# Altium schematic sheet 1_PFC.SchDoc (part 4 of 4)
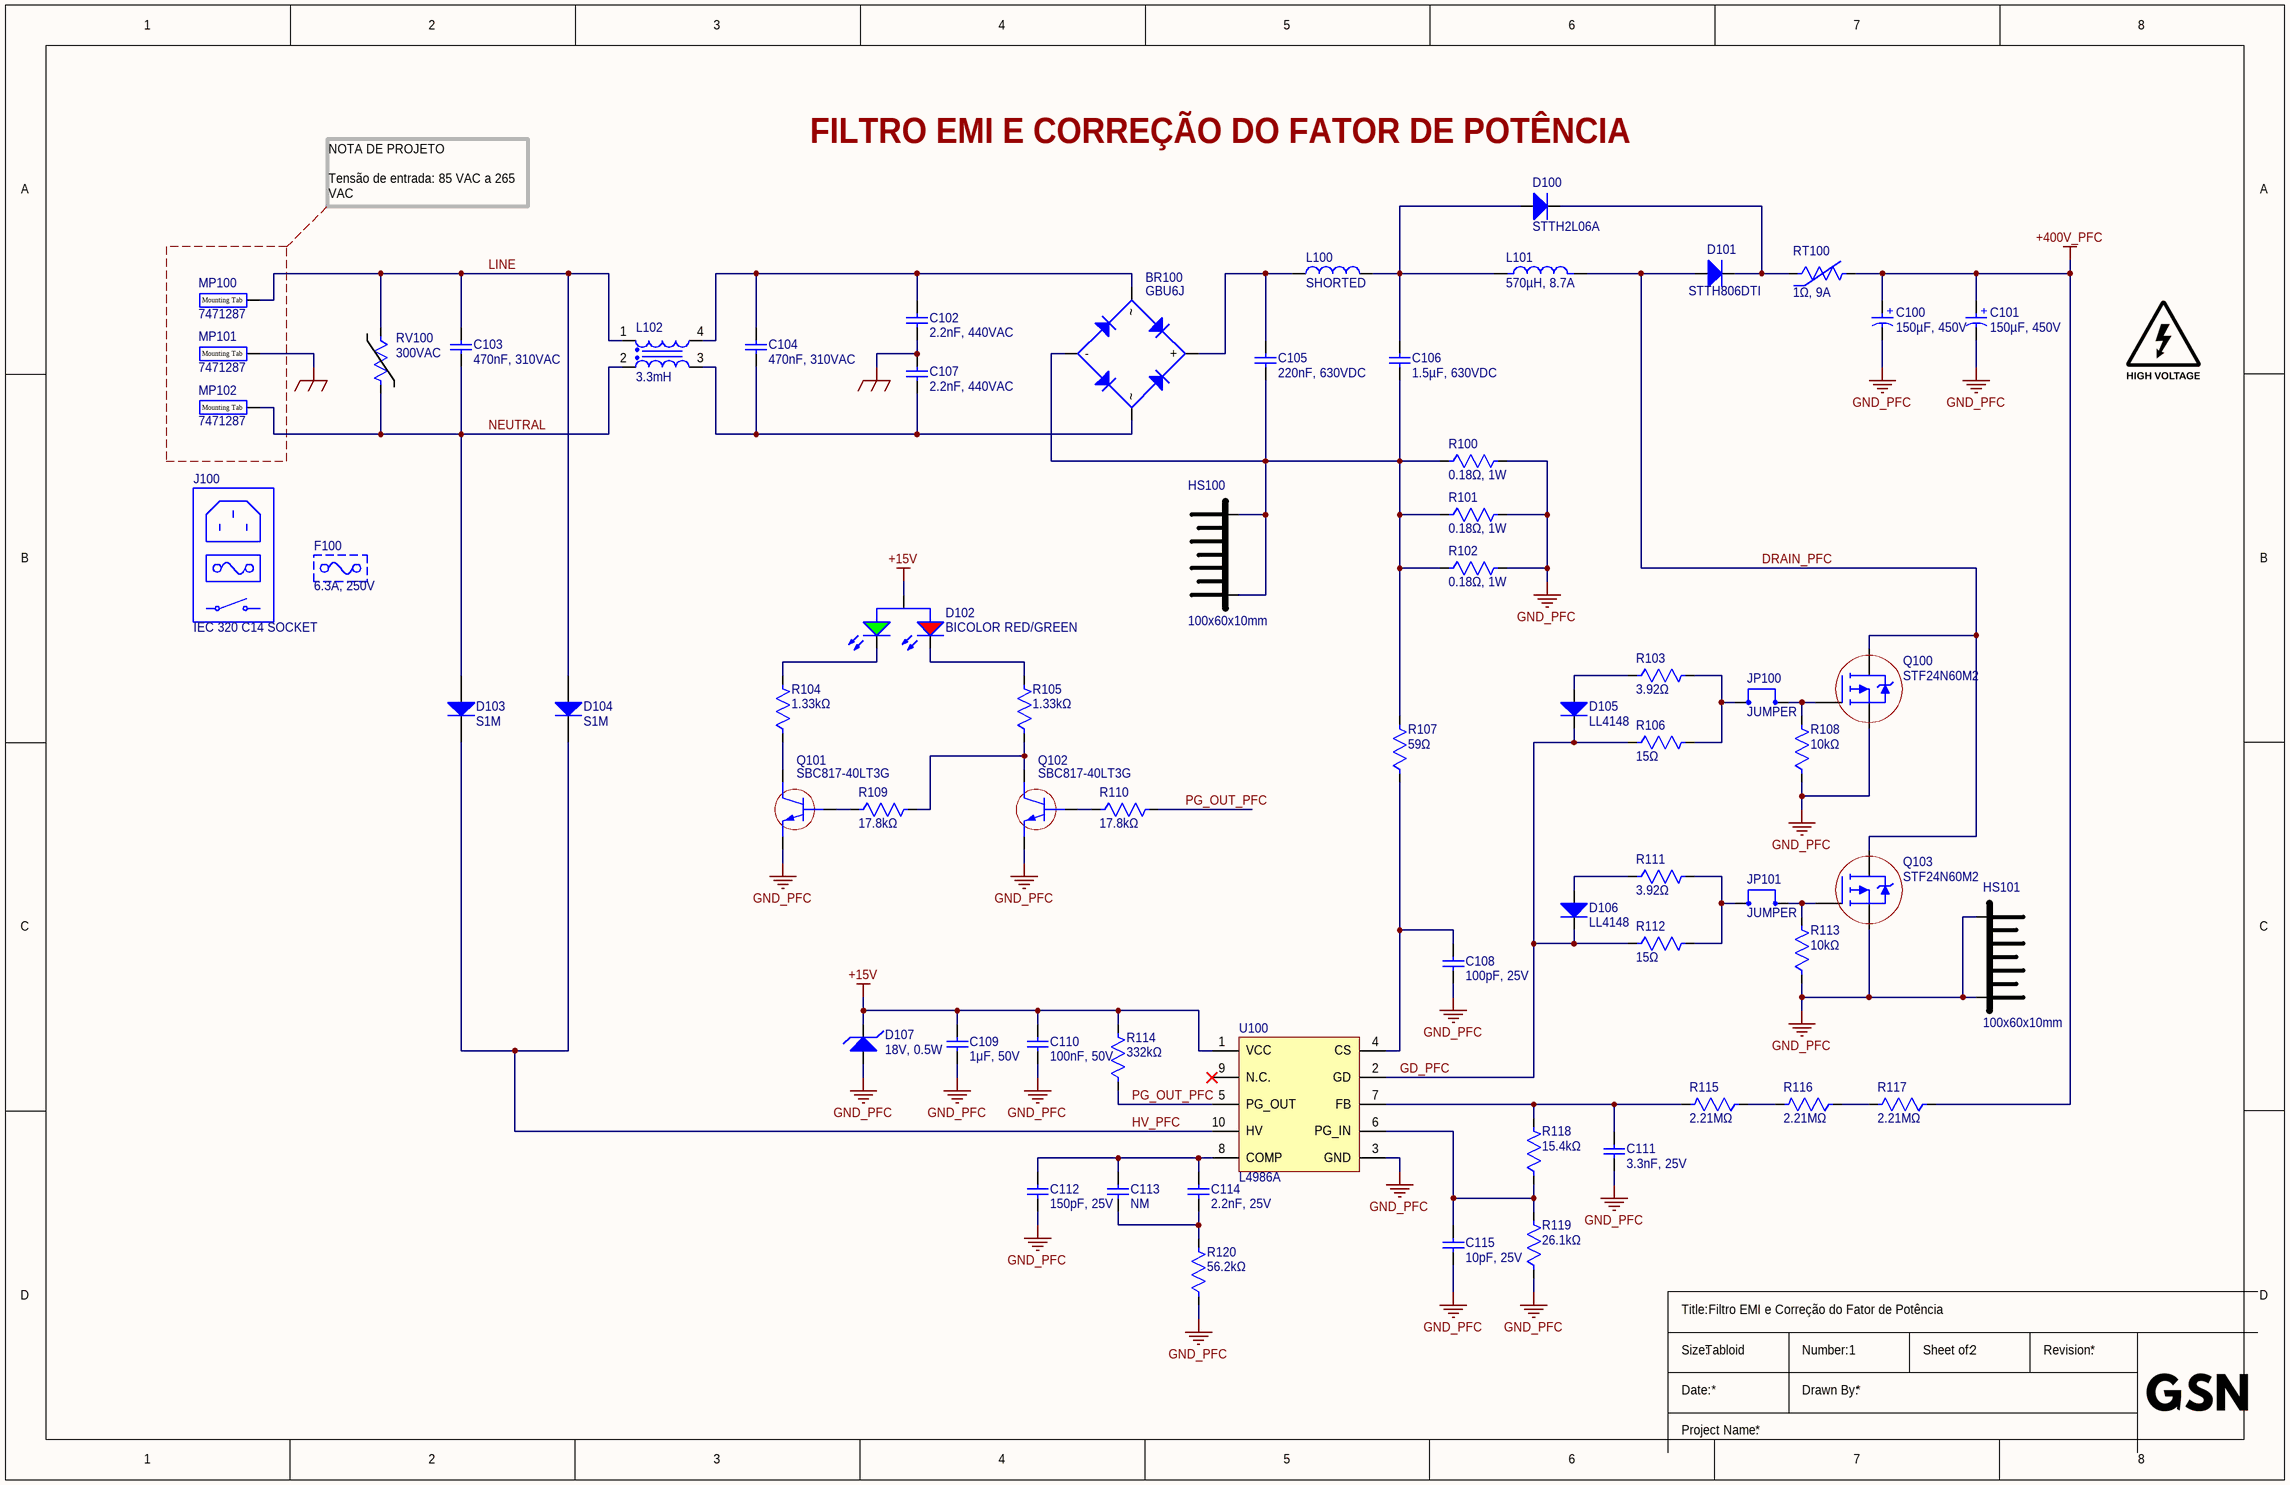
[diagram p3: 1_PFC.SchDoc]

## Library data of the parts (continued)
R108 R113 = RC0805FR-0710KL: RES 10K OHM 1% 1/8W 0805; Manufacturer: Yageo Group; Max Power Dissipation: 125mW; Temperature Coefficient: 100ppm/°C; Voltage Rating: 150V; Supplier: DigiKey; Supplier Part Number: 311-10.0KCRCT-ND; Manufacturer Part Number: RC0805FR-0710KL; RoHS: Compliant; Category: Chip SMD Resistors; Stock: 2846345; Pricing: 1=0.13, 10=0.009, 25=0.0088, 50=0.0082 (USD); Case/Package: 0805; Case Code (Imperial): 0805; China RoHS: Non-Compliant; Composition: Thick Film; Country of Origin: Mainland China, Taiwan; Depth: 1.25mm; Export Control Classification Number (ECCN) Code: EAR99; Features: Moisture Resistant; Height: 500µm; Harmonized Tariff Schedule (HTS) Code: 8533.21.00.30; Introduction Date: 2004-09-22; Lead Free: Lead Free; Length: 2mm; Lifecycle Status: Production; Max Operating Temperature: 155°C; Military Standard: Not; Min Operating Temperature: -55°C; Mounting Technology: Surface Mount; Pins: 2; Number of Terminals: 2; Number of Terminations: 2; Packaging: Tape and Reel; Power Dissipation: 125mW; Power Rating: 125mW; REACH SVHC: Yes; Value: 10kΩ; Schedule B: 8533210045, 8533210045|8533210045|8533210045|8533210045|8533210045|8533210045|8533210045|8533210045|8533210045|8533210045|8533210045|8533210045|8533210045|8533210045|8533210045|8533210045|8533210045|8533210045|8533210045|8533210045|8533210045|8533210045|8533210045|85; Termination: SMD/SMT; Tolerance: 1%; Voltage Rating (AC): 150V; Width: 1.25mm; Working Voltage: 150V; ComponentLink1URL: https://datasheet.octopart.com:443/RC0805FR-0710KL-Yageo-datasheet-175887523.pdf?src-supplier=Newark; ComponentLink1Description: https://datasheet.octopart.com:443/RC0805FR-0710KL-Yageo-datasheet-175887523.pdf?src-supplier=Newark; ComponentLink2URL: https://datasheet.octopart.com:443/RC0805FR-0710KL-Yageo-datasheet-62067350.pdf?src-supplier=Farnell; ComponentLink2Description: https://datasheet.octopart.com:443/RC0805FR-0710KL-Yageo-datasheet-62067350.pdf?src-supplier=Farnell; ComponentLink3URL: https://datasheet.octopart.com:443/RC0805FR-0710KL-Yageo-datasheet-13691069.pdf?src-supplier=Farnell; ComponentLink3Description: https://datasheet.octopart.com:443/RC0805FR-0710KL-Yageo-datasheet-13691069.pdf?src-supplier=Farnell; ComponentLink4URL: https://datasheet.octopart.com:443/RC0805FR-0710KL-Yageo-datasheet-103092701.pdf?src-supplier=Upverter; ComponentLink4Description: https://datasheet.octopart.com:443/RC0805FR-0710KL-Yageo-datasheet-103092701.pdf?src-supplier=Upverter; ComponentLink5URL: https://datasheet.octopart.com:443/RC0805FR-0710KL-Yageo-datasheet-98239111.pdf?src-supplier=Upverter; ComponentLink5Description: https://datasheet.octopart.com:443/RC0805FR-0710KL-Yageo-datasheet-98239111.pdf?src-supplier=Upverter; ComponentLink6URL: https://datasheet.octopart.com:443/RC0805FR-0710KL-Yageo---Phycomp-datasheet-67302840.pdf?src-supplier=Upverter; ComponentLink6Description: https://datasheet.octopart.com:443/RC0805FR-0710KL-Yageo---Phycomp-datasheet-67302840.pdf?src-supplier=Upverter; ComponentLink7URL: https://datasheet.octopart.com:443/RC0805FR-0710KL-Yageo-datasheet-8330313.pdf?src-supplier=element14+APAC; ComponentLink7Description: https://datasheet.octopart.com:443/RC0805FR-0710KL-Yageo-datasheet-8330313.pdf?src-supplier=element14+APAC; ComponentLink8URL: https://datasheet.octopart.com:443/RC0805FR-0710KL-Yageo-datasheet-12592811.pdf?src-supplier=element14+APAC; ComponentLink8Description: https://datasheet.octopart.com:443/RC0805FR-0710KL-Yageo-datasheet-12592811.pdf?src-supplier=element14+APAC; ComponentLink9URL: https://datasheet.octopart.com:443/RC0805FR-0710KL-Yageo-Group-datasheet-190305687.pdf?src-supplier=Future+Electronics; ComponentLink9Description: https://datasheet.octopart.com:443/RC0805FR-0710KL-Yageo-Group-datasheet-190305687.pdf?src-supplier=Future+Electronics; ComponentLink10URL: https://datasheet.octopart.com:443/RC0805FR-0710KL-Yageo-datasheet-164759695.pdf?src-supplier=Future+Electronics; ComponentLink10Description: https://datasheet.octopart.com:443/RC0805FR-0710KL-Yageo-datasheet-164759695.pdf?src-supplier=Future+Electronics; ComponentLink11URL: https://datasheet.octopart.com:443/RC0805FR-0710KL-Yageo-datasheet-15800360.pdf?src-supplier=Future+Electronics; ComponentLink11Description: https://datasheet.octopart.com:443/RC0805FR-0710KL-Yageo-datasheet-15800360.pdf?src-supplier=Future+Electronics; ComponentLink12URL: https://datasheet.octopart.com:443/RC0805FR-0710KL-Yageo-datasheet-8324252.pdf?src-supplier=Future+Electronics; ComponentLink12Description: https://datasheet.octopart.com:443/RC0805FR-0710KL-Yageo-datasheet-8324252.pdf?src-supplier=Future+Electronics; ComponentLink13URL: https://datasheet.octopart.com:443/RC0805FR-0710KL-Yageo-datasheet-79472498.pdf?src-supplier=Megastar; ComponentLink13Description: https://datasheet.octopart.com:443/RC0805FR-0710KL-Yageo-datasheet-79472498.pdf?src-supplier=Megastar; ComponentLink14URL: https://datasheet.octopart.com:443/RC0805FR-0710KL-Yageo-datasheet-27714392.pdf?src-supplier=Seeed+Studio; ComponentLink14Description: https://datasheet.octopart.com:443/RC0805FR-0710KL-Yageo-datasheet-27714392.pdf?src-supplier=Seeed+Studio; ComponentLink15URL: https://datasheet.octopart.com/RC0805FR-0710KL-Yageo-datasheet-73766026.pdf; ComponentLink15Description: https://datasheet.octopart.com/RC0805FR-0710KL-Yageo-datasheet-73766026.pdf; ComponentLink16URL: https://datasheet.octopart.com:443/RC0805FR-0710KL-Yageo-datasheet-118657.pdf?src-supplier=DigiKey; ComponentLink16Description: https://datasheet.octopart.com:443/RC0805FR-0710KL-Yageo-datasheet-118657.pdf?src-supplier=DigiKey; ComponentLink17URL: https://datasheet.octopart.com:443/RC0805FR-0710KL-Yageo-datasheet-502840.pdf?src-supplier=element14; ComponentLink17Description: https://datasheet.octopart.com:443/RC0805FR-0710KL-Yageo-datasheet-502840.pdf?src-supplier=element14; ComponentLink18URL: http://sigma.octopart.com:80/conflict_mineral_statement/Yageo-company-3.pdf?src-supplier=Compliance+Statements; ComponentLink18Description: http://sigma.octopart.com:80/conflict_mineral_statement/Yageo-company-3.pdf?src-supplier=Compliance+Statements; ComponentLink19URL: http://sigma.octopart.com:80/rohs_statement/Yageo-company-2.pdf?src-supplier=Compliance+Statements; ComponentLink19Description: http://sigma.octopart.com:80/rohs_statement/Yageo-company-2.pdf?src-supplier=Compliance+Statements
R109 R110 = RC0603FR-0717K8L: RES 17.8K OHM 1% 1/10W 0603; Manufacturer: Yageo Group; Max Power Dissipation: 100mW; Temperature Coefficient: ±200ppm/°C; Voltage Rating (AC): 50V; Voltage Rating: 75V; Supplier Part Number: 311-17.8KHRCT-ND; Manufacturer Part Number: RC0603FR-0717K8L; Value: 17.8kΩ; Case Code (Imperial): 0603; Case Code (Metric): 1608; Case/Package: 0603; Category: Chip SMD Resistors; China RoHS: Non-Compliant; Composition: Thick Film; Contact Plating: Tin; Depth: 800µm; Features: Moisture Resistant; Height: 450µm; Lead Free: Lead Free; Length: 1.6mm; Lifecycle Status: Production; Max Operating Temperature: 155°C; Military Standard: Not; Min Operating Temperature: -55°C; Mounting Technology: Surface Mount; Number of Terminals: 2; Number of Terminations: 2; Packaging: Tape & Reel; Power Dissipation: 100mW; Power Rating: 100mW; Radiation Hardening: No; REACH SVHC: Yes; RoHS: Compliant; Supplier: DigiKey; Termination: SMD/SMT; Tolerance: 1%; Component Link Description: https://www.yageogroup.com/content/datasheet/asset/file/PYU-RC_GROUP_51_ROHS_L; Component Link URL: https://www.yageogroup.com/content/datasheet/asset/file/PYU-RC_GROUP_51_ROHS_L; Datasheet: https://www.yageogroup.com/content/datasheet/asset/file/PYU-RC_GROUP_51_ROHS_L; Voltage Rating (DC): 50V; Weight: 2.012816mg; Width: 800µm; Working Voltage: 75V
R114 = RC0603FR-07332KL: RES 332K OHM 1% 1/10W 0603; Manufacturer: Yageo Group; Max Power Dissipation: 100mW; Temperature Coefficient: ±200ppm/°C; Voltage Rating (AC): 50V; Voltage Rating: 75V; Supplier Part Number: 311-332KHRCT-ND; Manufacturer Part Number: RC0603FR-07332KL; Value: 332kΩ; Case Code (Imperial): 0603; Case Code (Metric): 1608; Case/Package: 0603; Category: Chip SMD Resistors; China RoHS: Non-Compliant; Composition: Thick Film; Contact Plating: Tin; Depth: 800µm; Features: Moisture Resistant; Height: 450µm; Lead Free: Lead Free; Length: 1.6mm; Lifecycle Status: Production; Max Operating Temperature: 155°C; Military Standard: Not; Min Operating Temperature: -55°C; Mounting Technology: Surface Mount; Number of Terminals: 2; Number of Terminations: 2; Packaging: Tape & Reel; Power Dissipation: 100mW; Power Rating: 100mW; Radiation Hardening: No; REACH SVHC: Yes; RoHS: Compliant; Supplier: DigiKey; Termination: SMD/SMT; Tolerance: 1%; Component Link Description: https://www.yageogroup.com/content/datasheet/asset/file/PYU-RC_GROUP_51_ROHS_L; Component Link URL: https://www.yageogroup.com/content/datasheet/asset/file/PYU-RC_GROUP_51_ROHS_L; Datasheet: https://www.yageogroup.com/content/datasheet/asset/file/PYU-RC_GROUP_51_ROHS_L; Voltage Rating (DC): 50V; Weight: 2.012816mg; Width: 800µm; Working Voltage: 75V
R115-R117 = RC1206FR-072M21L: RES 2.21M OHM 1% 1/4W 1206; Manufacturer: Yageo Group; Max Power Dissipation: 250mW; Temperature Coefficient: 100ppm/°C; Voltage Rating: 200V; Supplier: DigiKey; Supplier Part Number: 311-2.21MFRCT-ND; Manufacturer Part Number: RC1206FR-072M21L; RoHS: Compliant; Category: Chip SMD Resistors; Stock: 1155; Pricing: 1=0.1, 10=0.011 (USD); Case/Package: 1206; Case Code (Imperial): 1206; Case Code (Metric): 3216; China RoHS: Non-Compliant; Composition: Thick Film; Contact Plating: Lead, Tin; Country of Origin: Mainland China, Taiwan; Depth: 1.6mm; Export Control Classification Number (ECCN) Code: EAR99; Features: Moisture Resistant; Height: 550µm; Harmonized Tariff Schedule (HTS) Code: 8533.21.00.30; Introduction Date: 2004-09-22; Lead Free: Lead Free; Length: 3.1mm; Lifecycle Status: Production; Max Operating Temperature: 155°C; Military Standard: Not; Min Operating Temperature: -55°C; Mounting Technology: Surface Mount; Number of Terminals: 2; Number of Terminations: 2; Power Dissipation: 250mW; Power Rating: 250mW; Radiation Hardening: No; REACH SVHC: Yes; Value: 2.21MΩ; Schedule B: 8533210045, 8533210045|8533210045, 8533210045|8533210045|8533210045, 8533210045|8533210045|8533210045|8533210045; Termination: SMD/SMT; Tolerance: 1%; Voltage Rating (DC): 200V; Width: 1.6mm; Working Voltage: 200V; ComponentLink1URL: https://datasheet.octopart.com:443/RC1206FR-072M21L-Yageo-datasheet-175887523.pdf?src-supplier=IHS; ComponentLink1Description: https://datasheet.octopart.com:443/RC1206FR-072M21L-Yageo-datasheet-175887523.pdf?src-supplier=IHS; ComponentLink2URL: https://datasheet.octopart.com:443/RC1206FR-072M21L-Yageo-datasheet-103092701.pdf?src-supplier=Upverter; ComponentLink2Description: https://datasheet.octopart.com:443/RC1206FR-072M21L-Yageo-datasheet-103092701.pdf?src-supplier=Upverter; ComponentLink3URL: https://datasheet.octopart.com:443/RC1206FR-072M21L-Yageo-Group-datasheet-176638170.pdf?src-supplier=Future+Electronics; ComponentLink3Description: https://datasheet.octopart.com:443/RC1206FR-072M21L-Yageo-Group-datasheet-176638170.pdf?src-supplier=Future+Electronics; ComponentLink4URL: https://datasheet.octopart.com:443/RC1206FR-072M21L-Yageo-datasheet-164759695.pdf?src-supplier=Future+Electronics; ComponentLink4Description: https://datasheet.octopart.com:443/RC1206FR-072M21L-Yageo-datasheet-164759695.pdf?src-supplier=Future+Electronics; ComponentLink5URL: https://datasheet.octopart.com:443/RC1206FR-072M21L-Yageo-datasheet-137700087.pdf?src-supplier=Future+Electronics; ComponentLink5Description: https://datasheet.octopart.com:443/RC1206FR-072M21L-Yageo-datasheet-137700087.pdf?src-supplier=Future+Electronics; ComponentLink6URL: https://datasheet.octopart.com:443/RC1206FR-072M21L-Yageo-datasheet-27233761.pdf?src-supplier=Future+Electronics; ComponentLink6Description: https://datasheet.octopart.com:443/RC1206FR-072M21L-Yageo-datasheet-27233761.pdf?src-supplier=Future+Electronics; ComponentLink7URL: https://datasheet.octopart.com:443/RC1206FR-072M21L-Yageo-datasheet-13032847.pdf?src-supplier=Future+Electronics; ComponentLink7Description: https://datasheet.octopart.com:443/RC1206FR-072M21L-Yageo-datasheet-13032847.pdf?src-supplier=Future+Electronics; ComponentLink8URL: https://datasheet.octopart.com:443/RC1206FR-072M21L-Yageo-datasheet-8359522.pdf?src-supplier=Future+Electronics; ComponentLink8Description: https://datasheet.octopart.com:443/RC1206FR-072M21L-Yageo-datasheet-8359522.pdf?src-supplier=Future+Electronics; ComponentLink9URL: https://datasheet.octopart.com/RC1206FR-072M21L-Yageo-datasheet-73766026.pdf; ComponentLink9Description: https://datasheet.octopart.com/RC1206FR-072M21L-Yageo-datasheet-73766026.pdf; ComponentLink10URL: https://datasheet.octopart.com:443/RC1206FR-072M21L-Yageo-datasheet-118639.pdf?src-supplier=DigiKey; ComponentLink10Description: https://datasheet.octopart.com:443/RC1206FR-072M21L-Yageo-datasheet-118639.pdf?src-supplier=DigiKey; ComponentLink11URL: http://sigma.octopart.com:80/conflict_mineral_statement/Yageo-company-3.pdf?src-supplier=Compliance+Statements; ComponentLink11Description: http://sigma.octopart.com:80/conflict_mineral_statement/Yageo-company-3.pdf?src-supplier=Compliance+Statements; ComponentLink12URL: http://sigma.octopart.com:80/rohs_statement/Yageo-company-2.pdf?src-supplier=Compliance+Statements; ComponentLink12Description: http://sigma.octopart.com:80/rohs_statement/Yageo-company-2.pdf?src-supplier=Compliance+Statements
R118 = RC0603FR-0715K4L: RES 15.4K OHM 1% 1/10W 0603; Manufacturer: Yageo Group; Max Power Dissipation: 100mW; Temperature Coefficient: ±200ppm/°C; Voltage Rating (AC): 50V; Voltage Rating: 75V; Supplier Part Number: 311-15.4KHRCT-ND; Manufacturer Part Number: RC0603FR-0715K4L; Value: 15.4kΩ; Case Code (Imperial): 0603; Case Code (Metric): 1608; Case/Package: 0603; Category: Chip SMD Resistors; China RoHS: Non-Compliant; Composition: Thick Film; Contact Plating: Tin; Depth: 800µm; Features: Moisture Resistant; Height: 450µm; Lead Free: Lead Free; Length: 1.6mm; Lifecycle Status: Production; Max Operating Temperature: 155°C; Military Standard: Not; Min Operating Temperature: -55°C; Mounting Technology: Surface Mount; Number of Terminals: 2; Number of Terminations: 2; Packaging: Tape & Reel; Power Dissipation: 100mW; Power Rating: 100mW; Radiation Hardening: No; REACH SVHC: Yes; RoHS: Compliant; Supplier: DigiKey; Termination: SMD/SMT; Tolerance: 1%; Component Link Description: https://www.yageogroup.com/content/datasheet/asset/file/PYU-RC_GROUP_51_ROHS_L; Component Link URL: https://www.yageogroup.com/content/datasheet/asset/file/PYU-RC_GROUP_51_ROHS_L; Datasheet: https://www.yageogroup.com/content/datasheet/asset/file/PYU-RC_GROUP_51_ROHS_L; Voltage Rating (DC): 50V; Weight: 2.012816mg; Width: 800µm; Working Voltage: 75V
R119 = RC0603FR-0726K1L: RES 26.1K OHM 1% 1/10W 0603; Manufacturer: Yageo Group; Max Power Dissipation: 100mW; Temperature Coefficient: ±200ppm/°C; Voltage Rating (AC): 50V; Voltage Rating: 75V; Supplier Part Number: 311-26.1KHRCT-ND; Manufacturer Part Number: RC0603FR-0726K1L; Value: 26.1kΩ; Case Code (Imperial): 0603; Case Code (Metric): 1608; Case/Package: 0603; Category: Chip SMD Resistors; China RoHS: Non-Compliant; Composition: Thick Film; Contact Plating: Tin; Depth: 800µm; Features: Moisture Resistant; Height: 450µm; Lead Free: Lead Free; Length: 1.6mm; Lifecycle Status: Production; Max Operating Temperature: 155°C; Military Standard: Not; Min Operating Temperature: -55°C; Mounting Technology: Surface Mount; Number of Terminals: 2; Number of Terminations: 2; Packaging: Tape & Reel; Power Dissipation: 100mW; Power Rating: 100mW; Radiation Hardening: No; REACH SVHC: Yes; RoHS: Compliant; Supplier: DigiKey; Termination: SMD/SMT; Tolerance: 1%; Component Link Description: https://www.yageogroup.com/content/datasheet/asset/file/PYU-RC_GROUP_51_ROHS_L; Component Link URL: https://www.yageogroup.com/content/datasheet/asset/file/PYU-RC_GROUP_51_ROHS_L; Datasheet: https://www.yageogroup.com/content/datasheet/asset/file/PYU-RC_GROUP_51_ROHS_L; Voltage Rating (DC): 50V; Weight: 2.012816mg; Width: 800µm; Working Voltage: 75V
R120 = RC0603FR-0756K2L: RES 56.2K OHM 1% 1/10W 0603; Manufacturer: Yageo Group; Max Power Dissipation: 100mW; Temperature Coefficient: ±200ppm/°C; Voltage Rating (AC): 50V; Voltage Rating: 75V; Supplier Part Number: 311-56.2KHRCT-ND; Manufacturer Part Number: RC0603FR-0756K2L; Value: 56.2kΩ; Case Code (Imperial): 0603; Case Code (Metric): 1608; Case/Package: 0603; Category: Chip SMD Resistors; China RoHS: Non-Compliant; Composition: Thick Film; Contact Plating: Tin; Depth: 800µm; Features: Moisture Resistant; Height: 450µm; Lead Free: Lead Free; Length: 1.6mm; Lifecycle Status: Production; Max Operating Temperature: 155°C; Military Standard: Not; Min Operating Temperature: -55°C; Mounting Technology: Surface Mount; Number of Terminals: 2; Number of Terminations: 2; Packaging: Tape & Reel; Power Dissipation: 100mW; Power Rating: 100mW; Radiation Hardening: No; REACH SVHC: Yes; RoHS: Compliant; Supplier: DigiKey; Termination: SMD/SMT; Tolerance: 1%; Component Link Description: https://www.yageogroup.com/content/datasheet/asset/file/PYU-RC_GROUP_51_ROHS_L; Component Link URL: https://www.yageogroup.com/content/datasheet/asset/file/PYU-RC_GROUP_51_ROHS_L; Datasheet: https://www.yageogroup.com/content/datasheet/asset/file/PYU-RC_GROUP_51_ROHS_L; Voltage Rating (DC): 50V; Weight: 2.012816mg; Width: 800µm; Working Voltage: 75V
RT100 = B57237S0109M054: NTC THERMISTOR ICL S237/1/M54; Manufacturer: EPCOS; Power Dissipation: 3.1W; Ratings: VDE; Tolerance: 20%; Supplier: DigiKey; Supplier Part Number: 495-B57237S0109M054CT-ND; Manufacturer Part Number: B57237S0109M054; RoHS: Compliant; Category: Resistors; Stock: 1723; Pricing: 1=1.46, 5=1.29, 10=1.227, 25=1.152, 50=1.101, 100=1.0542 (USD); Export Control Classification Number (ECCN) Code: EAR99; Height: 22mm; Harmonized Tariff Schedule (HTS) Code: 8533.40.80.70; Introduction Date: 2019-05-03; Length: 15mm; Lifecycle Status: Production; Max Operating Temperature: 170°C; Min Operating Temperature: -55°C; Number of Terminals: 2; REACH SVHC: No; Value: 1Ω; Width: 7mm; ComponentLink1URL: https://datasheet.octopart.com:443/B57237S0109M054-EPCOS-datasheet-155389212.pdf?src-supplier=IHS; ComponentLink1Description: https://datasheet.octopart.com:443/B57237S0109M054-EPCOS-datasheet-155389212.pdf?src-supplier=IHS
RV100 = B72214S0301K101: Var MOV 300VAC/385VDC 4500A 470V Thru-Hole Radial Automotive Bulk; Manufacturer: EPCOS; Value: 400pF; Clamping Current: 50A; Clamping Voltage: 775V; Energy: 76J; Lead Length: 30mm; Max Surge Current: 4.5kA; Max Voltage Rating (AC): 300V; Max Voltage Rating (DC): 385V; Power Dissipation: 600mW; Tolerance: 10%; Supplier: DigiKey; Supplier Part Number: 495-3789-ND; Manufacturer Part Number: B72214S0301K101; RoHS: Compliant; Category: Resistors; Stock: 24616; Pricing: 1=0.37, 10=0.258, 25=0.23, 100=0.1988, 250=0.18396, 500=0.17498, 1000=0.1676, 2500=0.15981, 5000=0.15511 (USD); Case/Package: Radial; China RoHS: Compliant; Contact Plating: Tin; Depth: 5.2mm; Diameter: 14mm; Height: 18.5mm; Lead/Base Style: Radial; Lead Pitch: 7.5mm; Lifecycle Status: Production; Max Operating Temperature: 105°C; Min Operating Temperature: -40°C; Mounting Technology: Radial, Through Hole; Number of Terminals: 2; Packaging: Bulk; REACH SVHC: Yes; Thickness: 5.2mm; Varistor Voltage: 470V; Voltage Rating (AC): 300V; Voltage Rating (DC): 385V; Voltage Tolerance: 10%; Weight: 4.000004g; Width: 5.2mm; Working Voltage: 385V; ComponentLink1URL: https://datasheet.octopart.com:443/B72214S0301K101-EPCOS-datasheet-136998859.pdf?src-supplier=Burklin+Elektronik; ComponentLink1Description: https://datasheet.octopart.com:443/B72214S0301K101-EPCOS-datasheet-136998859.pdf?src-supplier=Burklin+Elektronik; ComponentLink2URL: https://datasheet.octopart.com:443/B72214S0301K101-EPCOS-datasheet-109678825.pdf?src-supplier=Ciiva; ComponentLink2Description: https://datasheet.octopart.com:443/B72214S0301K101-EPCOS-datasheet-109678825.pdf?src-supplier=Ciiva; ComponentLink3URL: https://datasheet.octopart.com:443/B72214S0301K101-EPCOS-datasheet-62114839.pdf?src-supplier=Newark; ComponentLink3Description: https://datasheet.octopart.com:443/B72214S0301K101-EPCOS-datasheet-62114839.pdf?src-supplier=Newark; ComponentLink4URL: https://datasheet.octopart.com:443/B72214S0301K101-EPCOS-datasheet-38159044.pdf?src-supplier=Newark; ComponentLink4Description: https://datasheet.octopart.com:443/B72214S0301K101-EPCOS-datasheet-38159044.pdf?src-supplier=Newark; ComponentLink5URL: https://datasheet.octopart.com:443/B72214S0301K101-EPCOS-datasheet-11776948.pdf?src-supplier=element14+APAC; ComponentLink5Description: https://datasheet.octopart.com:443/B72214S0301K101-EPCOS-datasheet-11776948.pdf?src-supplier=element14+APAC; ComponentLink6URL: https://datasheet.octopart.com:443/B72214S0301K101-EPCOS-datasheet-567204.pdf?src-supplier=Farnell; ComponentLink6Description: https://datasheet.octopart.com:443/B72214S0301K101-EPCOS-datasheet-567204.pdf?src-supplier=Farnell; ComponentLink7URL: https://datasheet.octopart.com:443/B72214S0301K101-EPCOS-datasheet-1837.pdf?src-supplier=Farnell; ComponentLink7Description: https://datasheet.octopart.com:443/B72214S0301K101-EPCOS-datasheet-1837.pdf?src-supplier=Farnell; ComponentLink8URL: https://datasheet.octopart.com:443/B72214S0301K101-EPCOS-datasheet-99940739.pdf?src-supplier=TME; ComponentLink8Description: https://datasheet.octopart.com:443/B72214S0301K101-EPCOS-datasheet-99940739.pdf?src-supplier=TME; ComponentLink9URL: https://datasheet.octopart.com:443/B72214S0301K101-EPCOS-datasheet-17565824.pdf?src-supplier=TME; ComponentLink9Description: https://datasheet.octopart.com:443/B72214S0301K101-EPCOS-datasheet-17565824.pdf?src-supplier=TME
U100 = L4986A: CCM PFC CONTROLLER WITH HIGH VOL; Manufacturer: STMicroelectronics; Max Supply Voltage: 24.5V; Max Supply Current: 4.7mA; Max Switching Frequency: 71kHz; Min Input Voltage: 10V; Nominal Supply Voltage: 15V; Number of Circuits: 1; Topology: Boost; Supplier: DigiKey; Supplier Part Number: 497-L4986A-ND; Manufacturer Part Number: L4986A; RoHS: Compliant; Category: Power Factor Correction (PFC) Controllers; Stock: 138; Pricing: 1=3.49, 10=2.623, 25=2.4068, 100=2.1695, 300=2.0371, 500=1.98814, 1000=1.93198, 2500=1.87271, 5000=1.83699 (USD); Case/Package: SOP; China RoHS: Compliant; Country of Origin: Mainland China; Export Control Classification Number (ECCN) Code: EAR99; Height - Seated (Max): 1.75mm; Harmonized Tariff Schedule (HTS) Code: 8542.39.00.60; Introduction Date: 2021-07-28; Length: 4.9mm; Lifecycle Status: Production; Max Operating Temperature: 125°C; Min Operating Temperature: -25°C; Number of Terminals: 10; REACH SVHC: Yes; Terminal Pitch: 1mm; Width: 3.9mm